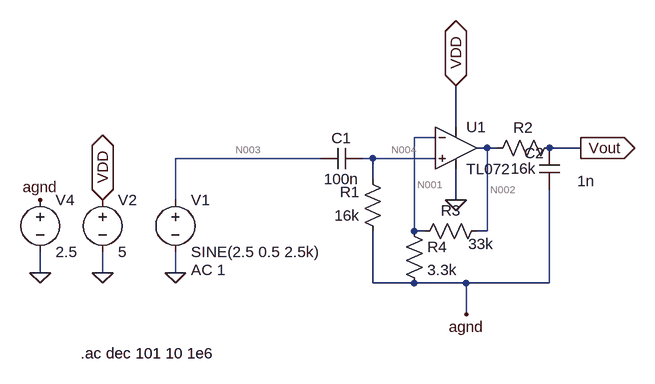
[diagram p0: schematic filtre_pass_band_final.asc]
* filtre_pass_band_final.asc
R1 agnd N004 16k
R2 Vout N002 16k
C1 N004 N003 100n
C2 agnd Vout 1n
R4 N001 agnd 3.3k
* U1: TL072 (symbol TL072 not available, pins judged from their places): In+=N004 In-=N001 V+=VDD V-=0 OUT=N002
R3 N002 N001 33k
V1 N003 0 SINE(2.5 0.5 2.5k) AC 1
V2 VDD 0 5
V4 agnd 0 2.5
.ac dec 101 10 1e6
.backanno
.end

* Results of the author's LTspice run, read from the files saved beside the schematic
* Operating Point, zero values left out:
*   V(agnd) = 2.5 V
*   V(n004) = 2.5 V
*   V(vout) = 2.5 V
*   V(n002) = 2.5 V
*   V(n003) = 2.5 V
*   V(n001) = 2.5 V
*   V(vdd) = 5 V
*   I(R3) = 3.199 nA
*   I(R4) = 3.166 nA
*   I(R1) = 32.55 pA
*   I(V4) = 3.134 nA
*   I(V2) = -2.528 mA
*   Ix(u1:1) = 32.55 pA
*   Ix(u1:2) = 32.55 pA
*   Ix(u1:3) = 2.528 mA
*   Ix(u1:4) = -2.529 mA
*   Ix(u1:5) = -3.199 nA
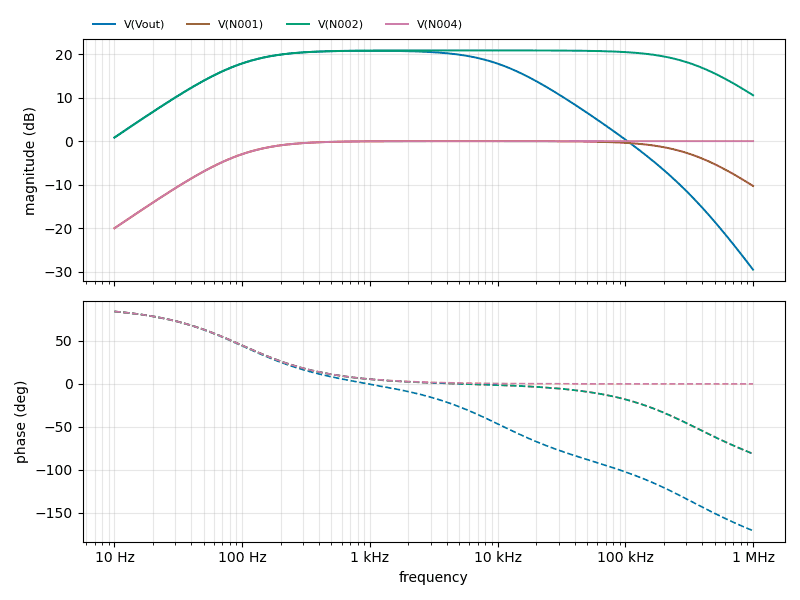
[diagram p1: AC Analysis of filtre_pass_band_final.asc, plotted from the saved traces]
* AC Analysis, 1 run:
*   V(Vout): 0.83 dB at 10 Hz, -29.52 dB at 1 MHz, peak 20.74 dB at 1 kHz, 3 dB below the peak at 97.54 Hz and 10.14 kHz
*   V(N001): -20.00 dB at 10 Hz, -10.30 dB at 1 MHz, peak -0.00 dB at 6.338 kHz, 3 dB below the peak at 99.43 Hz and 325 kHz
*   V(N002): 0.83 dB at 10 Hz, 10.53 dB at 1 MHz, peak 20.83 dB at 6.338 kHz, 3 dB below the peak at 99.43 Hz and 325 kHz
*   V(N004): -20.00 dB at 10 Hz, -0.00 dB at 1 MHz, peak -0.00 dB at 1 MHz, 3 dB below the peak at 99.48 Hz